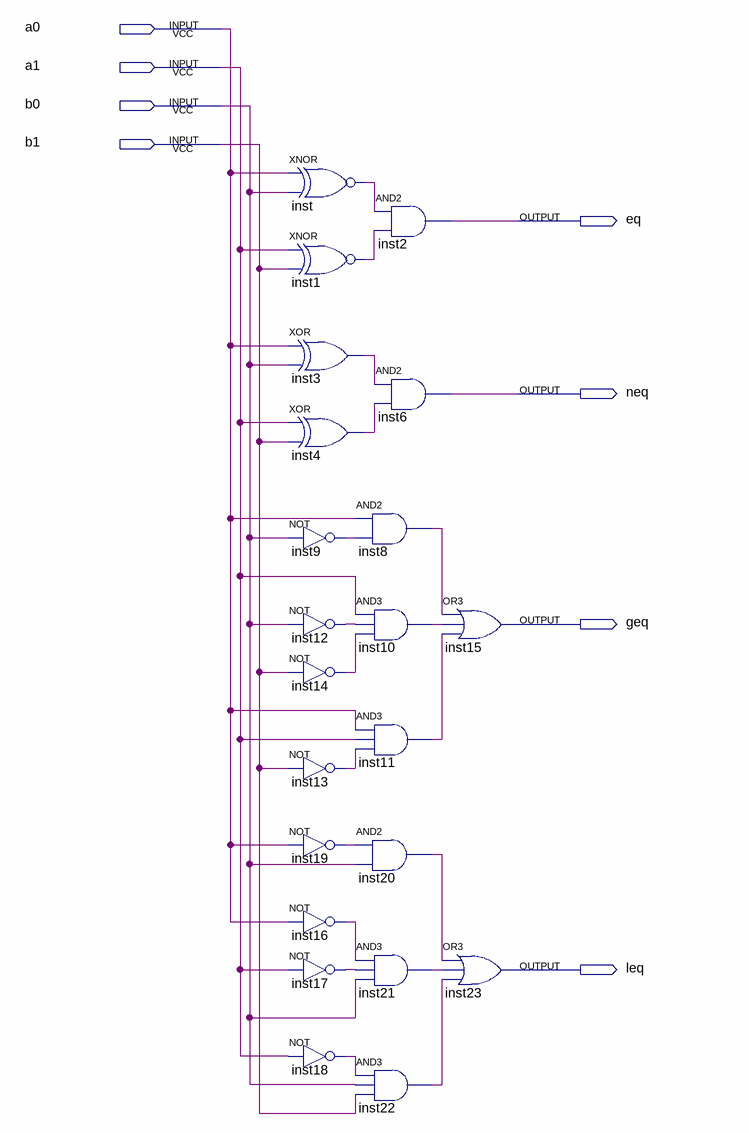
[diagram p0: schematic sheet]
// Quartus schematic TwoBitComparator.bdf as structural Verilog: 22 symbols, 8 pins
module TwoBitComparator (
  input  a0,
  input  a1,
  input  b0,
  input  b1,
  output eq,
  output neq,
  output geq,
  output leq
);

  wire inst1_out, inst3_out, inst4_out, inst8_out, inst9_out, inst10_out, inst11_out, inst12_out, inst13_out,
       inst14_out, inst16_out, inst17_out, inst18_out, inst19_out, inst20_out, inst21_out, inst22_out,
       inst_out;

  xnor inst (inst_out, a0, b0);
  xnor inst1 (inst1_out, a1, b1);
  xor inst3 (inst3_out, a0, b0);
  xor inst4 (inst4_out, a1, b1);
  not inst9 (inst9_out, b0);
  not inst12 (inst12_out, b0);
  not inst14 (inst14_out, b1);
  not inst13 (inst13_out, b1);
  not inst19 (inst19_out, a0);
  not inst16 (inst16_out, a0);
  not inst17 (inst17_out, a1);
  not inst18 (inst18_out, a1);
  and inst2 (eq, inst_out, inst1_out);
  and inst6 (neq, inst3_out, inst4_out);
  and inst8 (inst8_out, a0, inst9_out);
  and inst10 (inst10_out, a1, inst12_out, inst14_out);
  and inst11 (inst11_out, a0, a1, inst13_out);
  and inst20 (inst20_out, inst19_out, b0);
  and inst21 (inst21_out, inst16_out, inst17_out, b0);
  and inst22 (inst22_out, inst18_out, b0, b1);
  or inst15 (geq, inst8_out, inst10_out, inst11_out);
  or inst23 (leq, inst20_out, inst21_out, inst22_out);
endmodule
